# EAGLE design piezo-driver_v0.2-R001 (EAGLE 6.5.0)
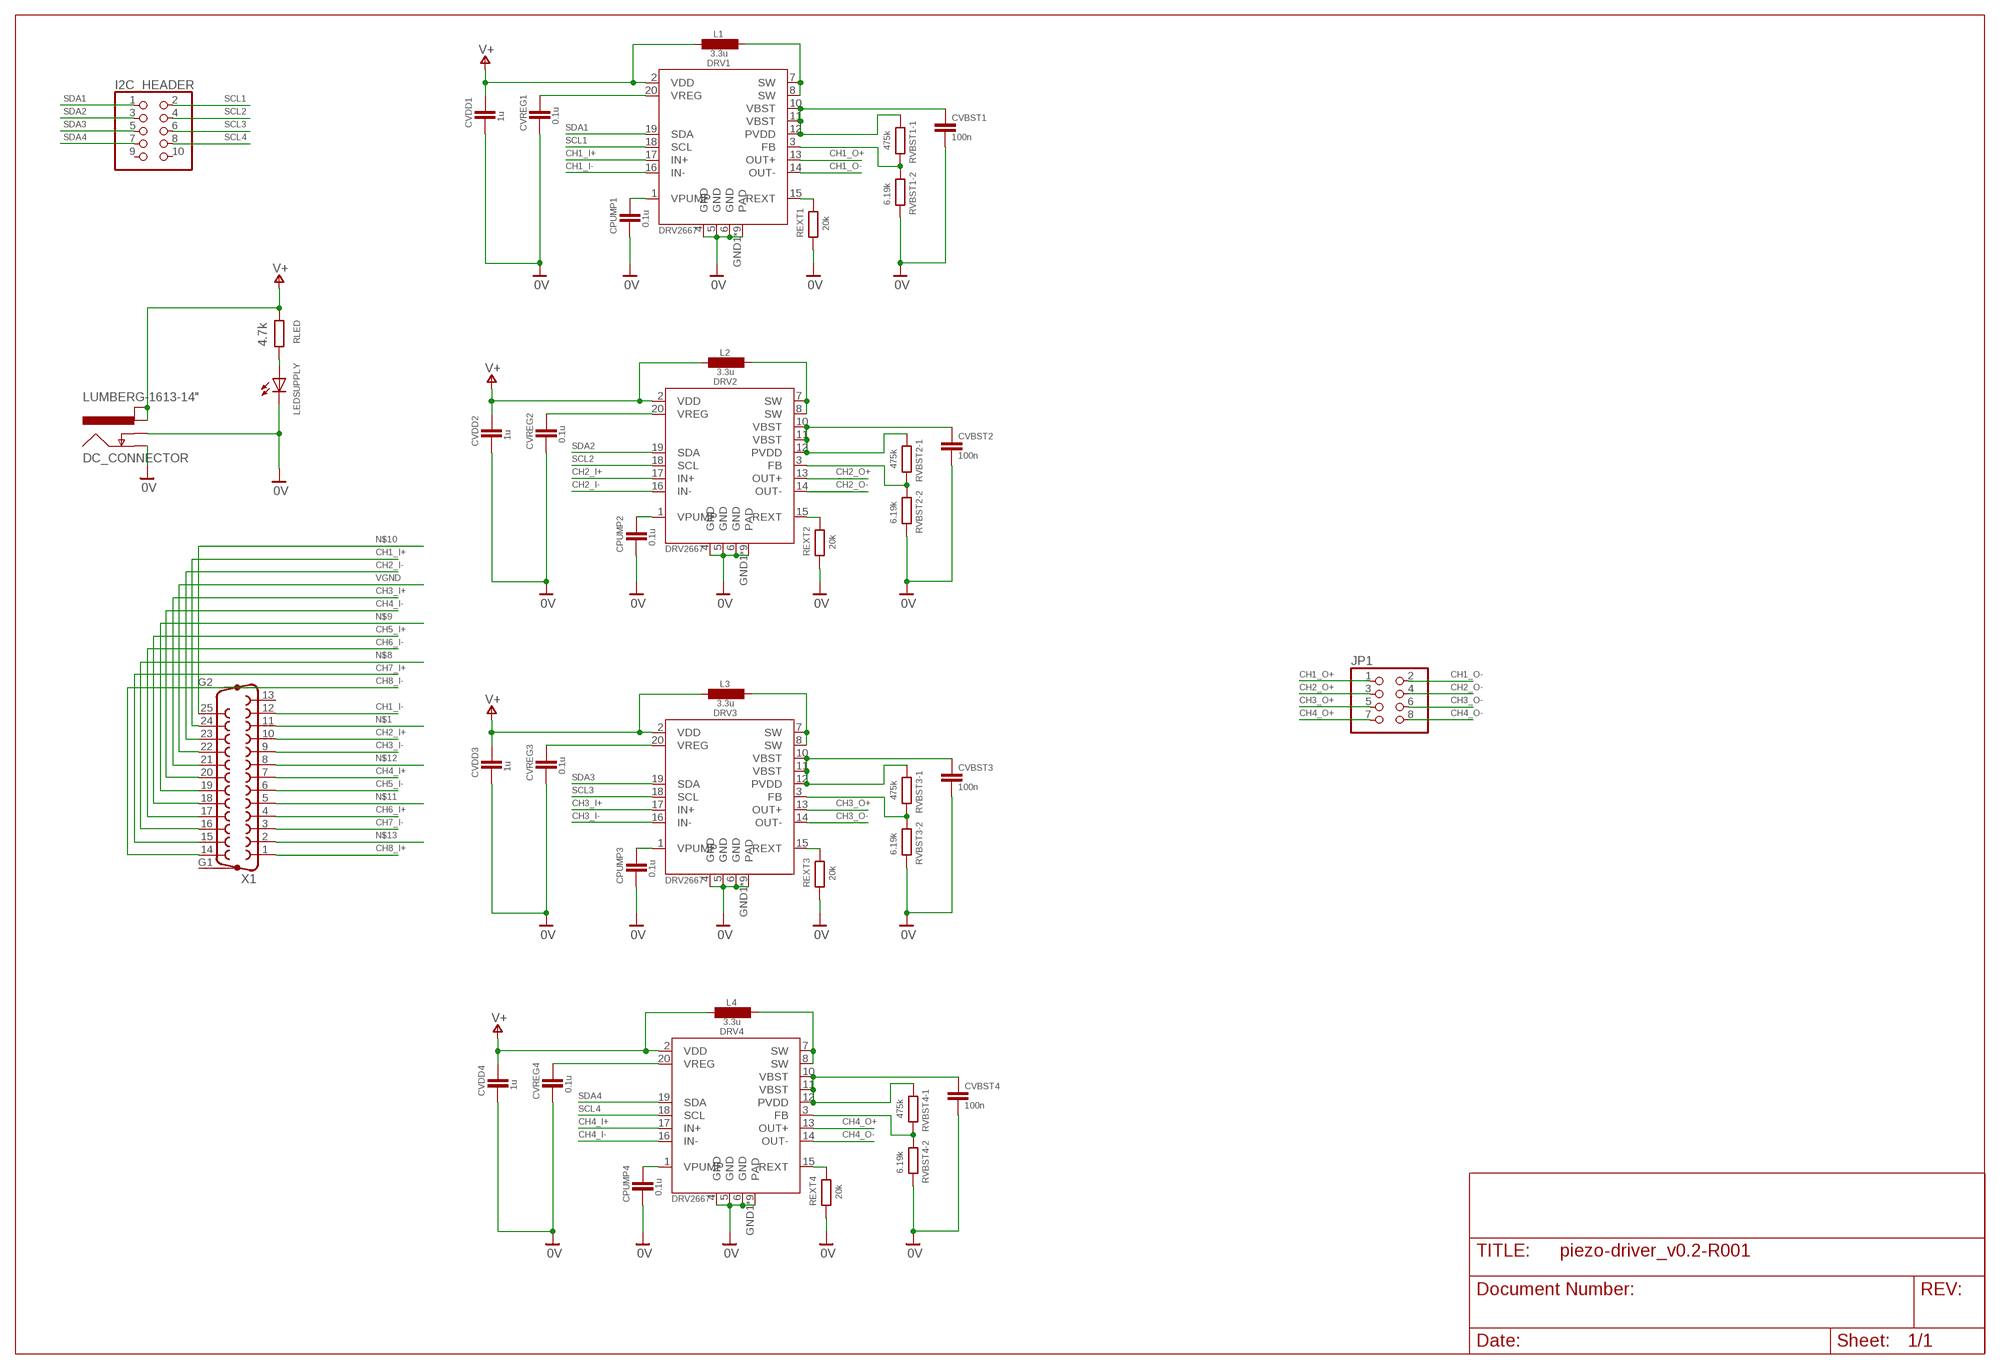
[diagram p0: schematic, sheet 1]

## Parts
CPUMP1  0.1u  C-EUC0805  [C0805]
CPUMP2  0.1u  C-EUC0805  [C0805]
CPUMP3  0.1u  C-EUC0805  [C0805]
CPUMP4  0.1u  C-EUC0805  [C0805]
CVBST1  100n  C-EUC0805  [C0805]
CVBST2  100n  C-EUC0805  [C0805]
CVBST3  100n  C-EUC0805  [C0805]
CVBST4  100n  C-EUC0805  [C0805]
CVDD1  1u  C-EUC0805  [C0805]
CVDD2  1u  C-EUC0805  [C0805]
CVDD3  1u  C-EUC0805  [C0805]
CVDD4  1u  C-EUC0805  [C0805]
CVREG1  0.1u  C-EUC0805  [C0805]
CVREG2  0.1u  C-EUC0805  [C0805]
CVREG3  0.1u  C-EUC0805  [C0805]
CVREG4  0.1u  C-EUC0805  [C0805]
DC_CONNECTOR  LUMBERG-1613-14"  [LUMBERG-1613_14]
DRV1  DRV2667QFN  [QFN400X400]
DRV2  DRV2667QFN  [QFN400X400]
DRV3  DRV2667QFN  [QFN400X400]
DRV4  DRV2667QFN  [QFN400X400]
I2C_HEADER  HEADER_2X52.54_FEMALE  [2X05_2.54]
JP1  PINHD-2X4/90  [2X04/90]
L1  3.3u  L-EUL3225M  [L3225M]
L2  3.3u  L-EUL3225M  [L3225M]
L3  3.3u  L-EUL3225M  [L3225M]
L4  3.3u  L-EUL3225M  [L3225M]
LEDSUPPLY  LED0603  [LED-0603]
REXT1  20k  R-EU_R0805  [R0805]
REXT2  20k  R-EU_R0805  [R0805]
REXT3  20k  R-EU_R0805  [R0805]
REXT4  20k  R-EU_R0805  [R0805]
RLED  4.7k  R-EU_R0805  [R0805]
RVBST1-1  475k  R-EU_R0805  [R0805]
RVBST1-2  6.19k  R-EU_R0805  [R0805]
RVBST2-1  475k  R-EU_R0805  [R0805]
RVBST2-2  6.19k  R-EU_R0805  [R0805]
RVBST3-1  475k  R-EU_R0805  [R0805]
RVBST3-2  6.19k  R-EU_R0805  [R0805]
RVBST4-1  475k  R-EU_R0805  [R0805]
RVBST4-2  6.19k  R-EU_R0805  [R0805]
X1  F25HP  [F25HP]

## Nets
0V: CPUMP1.2 CPUMP2.2 CPUMP3.2 CPUMP4.2 CVBST1.2 CVBST2.2 CVBST3.2 CVBST4.2 CVDD1.2 CVDD2.2 CVDD3.2 CVDD4.2 CVREG1.2 CVREG2.2 CVREG3.2 CVREG4.2 DC_CONNECTOR.1(GND) DC_CONNECTOR.2(GND_INS) DRV1.4(GND) DRV1.5(GND) DRV1.6(GND) DRV1.GND1(PAD) DRV1.GND2(PAD) DRV1.GND3(PAD) DRV1.GND4(PAD) DRV1.GND5(PAD) DRV1.GND6(PAD) DRV1.GND7(PAD) DRV1.GND8(PAD) DRV1.GND9(PAD) DRV2.4(GND) DRV2.5(GND) DRV2.6(GND) DRV2.GND1(PAD) DRV2.GND2(PAD) DRV2.GND3(PAD) DRV2.GND4(PAD) DRV2.GND5(PAD) DRV2.GND6(PAD) DRV2.GND7(PAD) DRV2.GND8(PAD) DRV2.GND9(PAD) DRV3.4(GND) DRV3.5(GND) DRV3.6(GND) DRV3.GND1(PAD) DRV3.GND2(PAD) DRV3.GND3(PAD) DRV3.GND4(PAD) DRV3.GND5(PAD) DRV3.GND6(PAD) DRV3.GND7(PAD) DRV3.GND8(PAD) DRV3.GND9(PAD) DRV4.4(GND) DRV4.5(GND) DRV4.6(GND) DRV4.GND1(PAD) DRV4.GND2(PAD) DRV4.GND3(PAD) DRV4.GND4(PAD) DRV4.GND5(PAD) DRV4.GND6(PAD) DRV4.GND7(PAD) DRV4.GND8(PAD) DRV4.GND9(PAD) LEDSUPPLY.C REXT1.1 REXT2.1 REXT3.1 REXT4.1 RVBST1-2.1 RVBST2-2.1 RVBST3-2.1 RVBST4-2.1
CH1_I+: DRV1.17(IN+) X1.24
CH1_I-: DRV1.16(IN-) X1.12
CH1_O+: DRV1.13(OUT+) JP1.1
CH1_O-: DRV1.14(OUT-) JP1.2
CH2_I+: DRV2.17(IN+) X1.10
CH2_I-: DRV2.16(IN-) X1.23
CH2_O+: DRV2.13(OUT+) JP1.3
CH2_O-: DRV2.14(OUT-) JP1.4
CH3_I+: DRV3.17(IN+) X1.21
CH3_I-: DRV3.16(IN-) X1.9
CH3_O+: DRV3.13(OUT+) JP1.5
CH3_O-: DRV3.14(OUT-) JP1.6
CH4_I+: DRV4.17(IN+) X1.7
CH4_I-: DRV4.16(IN-) X1.20
CH4_O+: DRV4.13(OUT+) JP1.7
CH4_O-: DRV4.14(OUT-) JP1.8
CH5_I+: X1.18
CH5_I-: X1.6
CH6_I+: X1.4
CH6_I-: X1.17
CH7_I+: X1.15
CH7_I-: X1.3
CH8_I+: X1.1
CH8_I-: X1.14
N$1: X1.11
N$2: DRV1.7(SW) DRV1.8(SW) L1.1
N$3: CVBST1.1 DRV1.10(VBST) DRV1.11(VBST) DRV1.12(PVDD) RVBST1-1.2
N$4: DRV1.3(FB) RVBST1-1.1 RVBST1-2.2
N$5: DRV1.15(REXT) REXT1.2
N$6: CPUMP1.1 DRV1.1(VPUMP)
N$7: CVREG1.1 DRV1.20(VREG)
N$8: X1.16
N$9: X1.19
N$10: X1.25
N$11: X1.5
N$12: X1.8
N$13: X1.2
N$15: LEDSUPPLY.A RLED.1
N$31: DRV2.7(SW) DRV2.8(SW) L2.1
N$32: CVBST2.1 DRV2.10(VBST) DRV2.11(VBST) DRV2.12(PVDD) RVBST2-1.2
N$33: DRV2.3(FB) RVBST2-1.1 RVBST2-2.2
N$34: DRV2.15(REXT) REXT2.2
N$35: CPUMP2.1 DRV2.1(VPUMP)
N$36: CVREG2.1 DRV2.20(VREG)
N$37: DRV3.7(SW) DRV3.8(SW) L3.1
N$38: CVBST3.1 DRV3.10(VBST) DRV3.11(VBST) DRV3.12(PVDD) RVBST3-1.2
N$39: DRV3.3(FB) RVBST3-1.1 RVBST3-2.2
N$40: DRV3.15(REXT) REXT3.2
N$41: CPUMP3.1 DRV3.1(VPUMP)
N$42: CVREG3.1 DRV3.20(VREG)
N$43: DRV4.7(SW) DRV4.8(SW) L4.1
N$44: CVBST4.1 DRV4.10(VBST) DRV4.11(VBST) DRV4.12(PVDD) RVBST4-1.2
N$45: DRV4.3(FB) RVBST4-1.1 RVBST4-2.2
N$46: DRV4.15(REXT) REXT4.2
N$47: CPUMP4.1 DRV4.1(VPUMP)
N$48: CVREG4.1 DRV4.20(VREG)
SCL1: DRV1.18(SCL) I2C_HEADER.2
SCL2: DRV2.18(SCL) I2C_HEADER.4
SCL3: DRV3.18(SCL) I2C_HEADER.6
SCL4: DRV4.18(SCL) I2C_HEADER.8
SDA1: DRV1.19(SDA) I2C_HEADER.1
SDA2: DRV2.19(SDA) I2C_HEADER.3
SDA3: DRV3.19(SDA) I2C_HEADER.5
SDA4: DRV4.19(SDA) I2C_HEADER.7
V+: CVDD1.1 CVDD2.1 CVDD3.1 CVDD4.1 DC_CONNECTOR.3(PWR_1) DC_CONNECTOR.4(PWR_2) DRV1.2(VDD) DRV2.2(VDD) DRV3.2(VDD) DRV4.2(VDD) L1.2 L2.2 L3.2 L4.2 RLED.2
VGND: X1.22
Unconnected: I2C_HEADER.9 I2C_HEADER.10 X1.13 X1.G1 X1.G2

## Library data of the parts
CPUMP1-CPUMP4 CVBST1-CVBST4 CVDD1-CVDD4 CVREG1-CVREG4 = SABRe:C-EU: CAPACITOR, European symbol
DC_CONNECTOR = SABRe:LUMBERG-1613-14
DRV1-DRV4 = ICST:DRV2667
I2C_HEADER = SABRe:HEADER_2X5: PIN HEADER
JP1 = ICST:PINHD-2X4: PIN HEADER
L1-L4 = SABRe:L-EU: INDUCTOR, European symbol
LEDSUPPLY = SABRe:LED: LEDs Standard schematic elements and footprints for packages: 5mm 3mm 1206 0603
REXT1-REXT4 RVBST1-1 RVBST1-2 RVBST2-1 RVBST2-2 RVBST3-1 RVBST3-2 RVBST4-1 RVBST4-2 = SABRe:R-EU_: RESISTOR, European symbol
RLED = rcl:R-EU_: RESISTOR, European symbol
X1 = ICST:F25HP: SUB-D; OC_FARNELL: unknown; OC_NEWARK: unknown

## Board
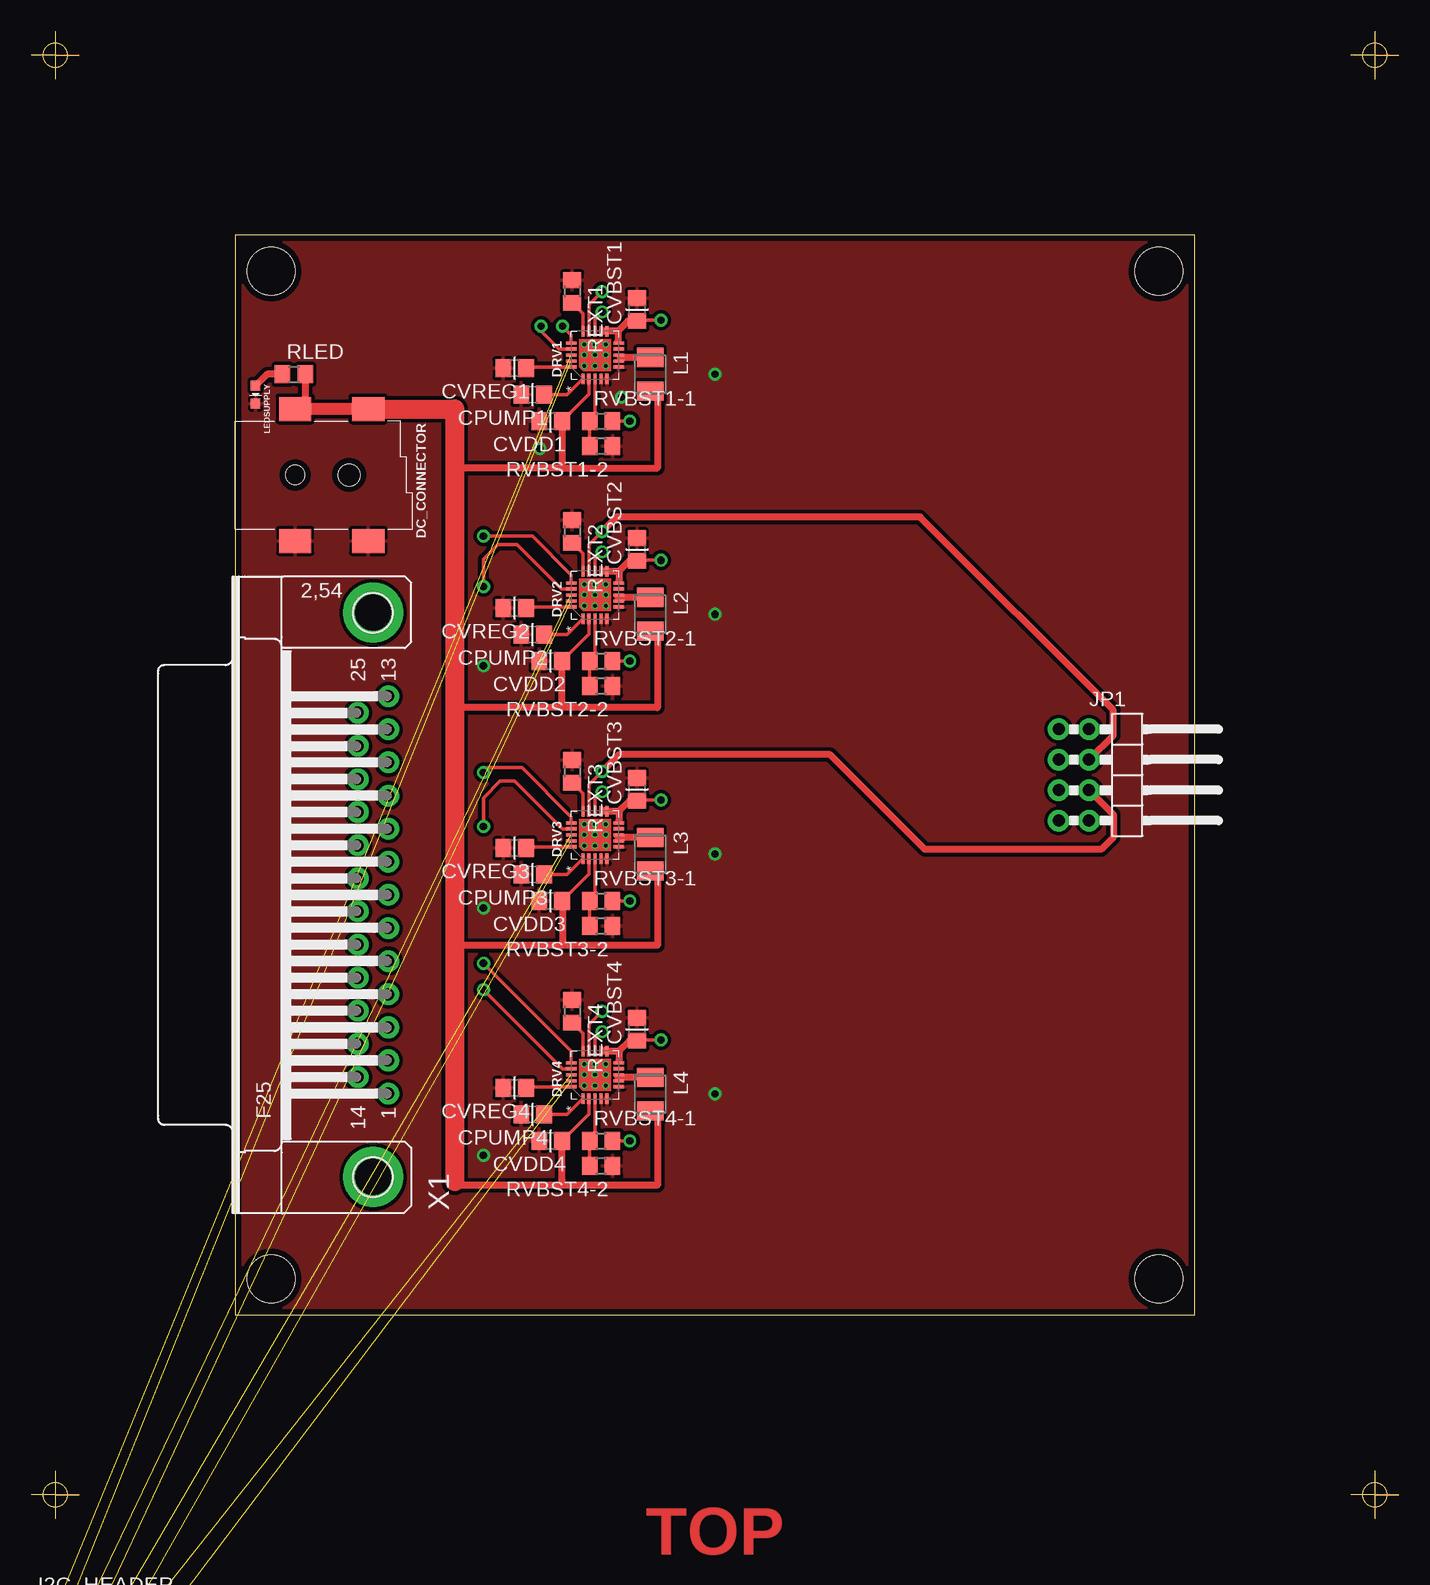
[diagram p1: board, top side]
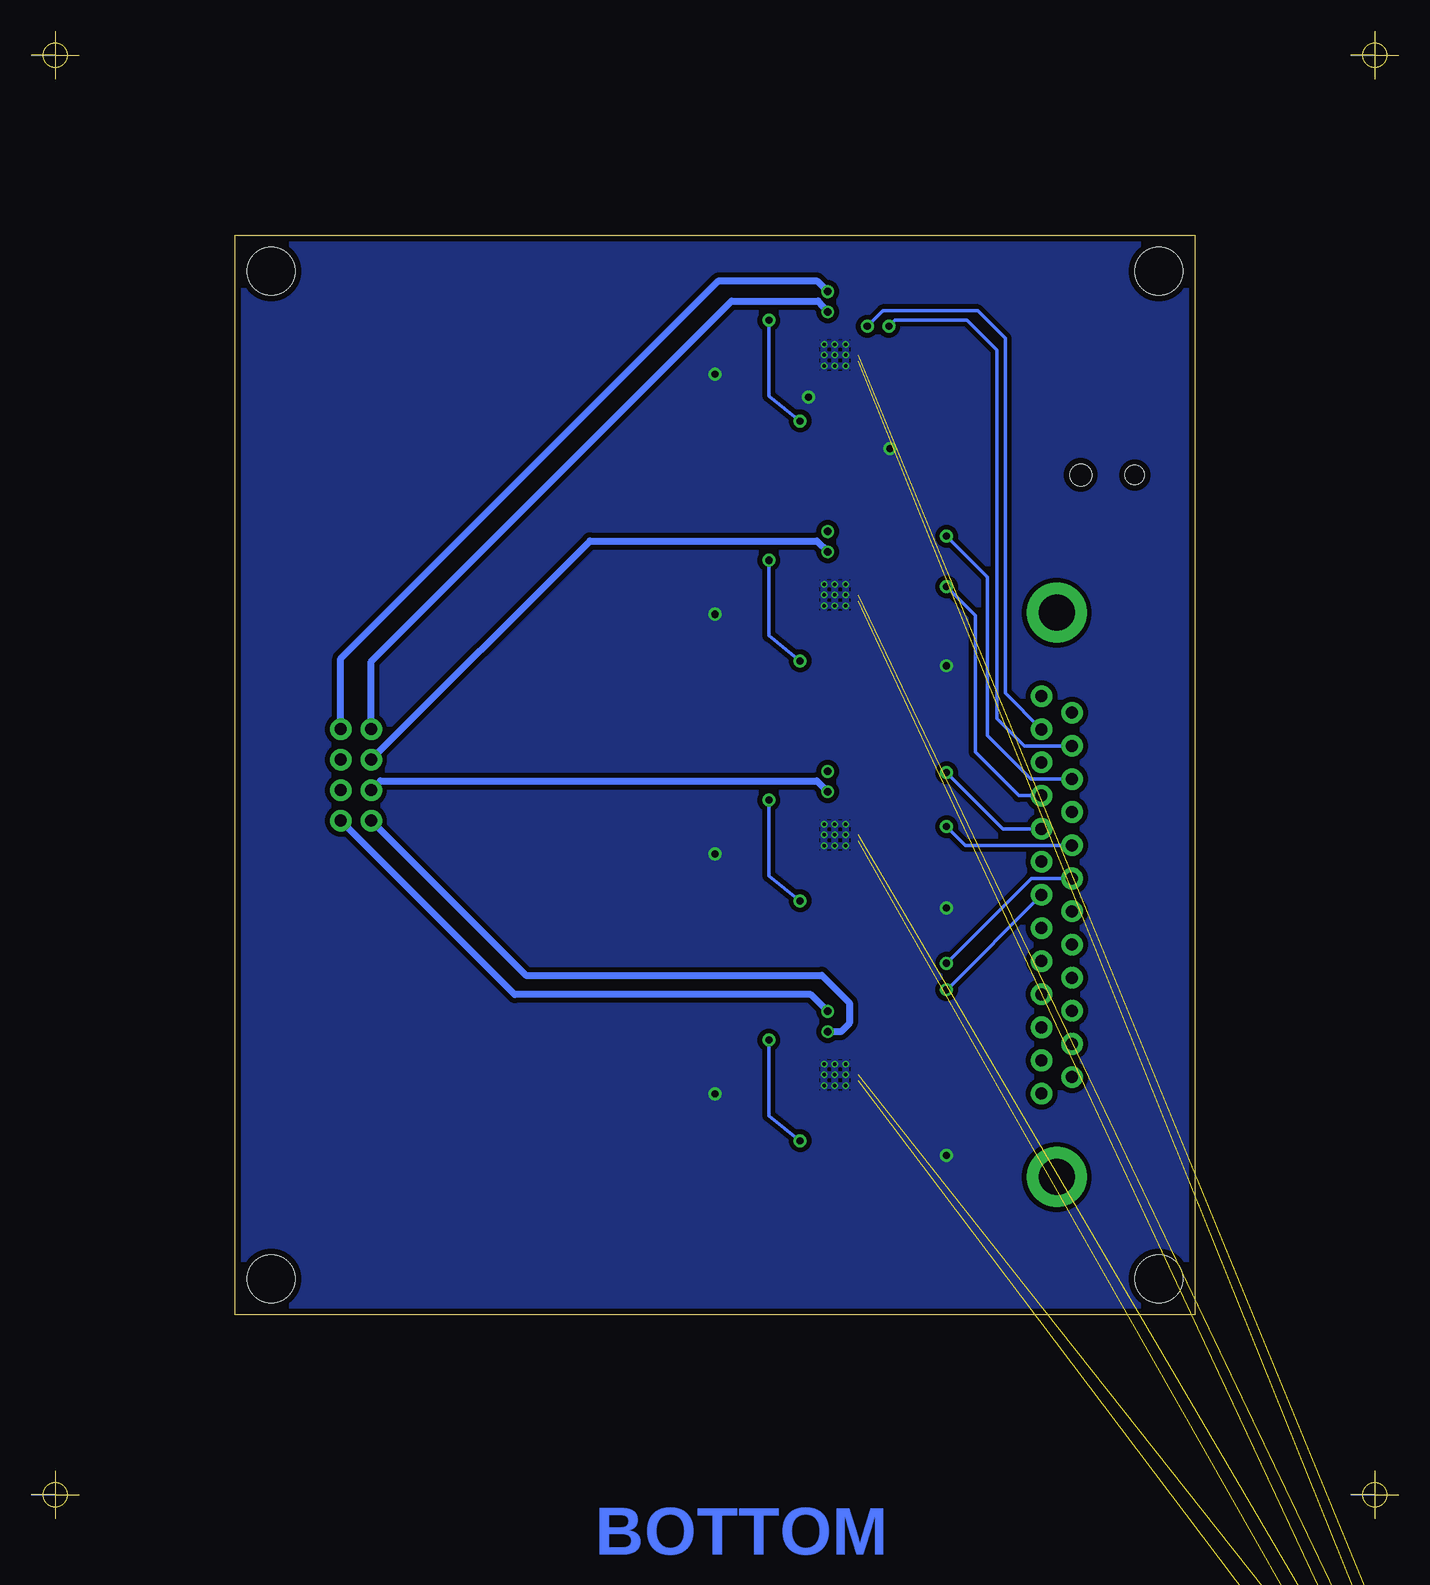
[diagram p2: board, bottom side, seen from below]

Size 114 x 124 mm. Coordinates in mm from the lower left corner, seen from the top.
Outline: 2,2 4,2
Outline: 2,4 2,2
Outline: 2,2 2,0
Outline: 2,2 0,2
Outline: 112,2 114,2
Outline: 112,4 112,2
Outline: 112,2 112,0
Outline: 112,2 110,2
Outline: 2,122 4,122
Outline: 2,124 2,122
Outline: 2,122 2,120
Outline: 2,122 0,122
Outline: 112,122 114,122
Outline: 112,124 112,122
Outline: 112,122 112,120
Outline: 112,122 110,122
Outline: 17,107 17,17 97,17 97,107 17,107
Outline: circle at 2,2 radius 1
Outline: circle at 112,2 radius 1
Outline: circle at 2,122 radius 1
Outline: circle at 112,122 radius 1
Copper layers (1*16): Top 0.035mm / dielectric 1.5mm / Bottom 0.035mm
Design rules "ICST_etching": minimum track width 0.3mm, minimum drill 0.6mm, track to track 0.15mm, track to pad 0.15mm, pad to pad 0.15mm, via to via 0.15mm, smd to smd 0.15mm, copper to edge 0.5mm, drill to drill 0.3mm, minimum pad ring 0.1mm, minimum via ring 0.1mm, stop-mask expansion 4mil, vias tented up to drill 25mil, thermal gap 10mil
Holes 4 mm at 20,104 94,104 94,20 20,20

### Footprints (pad centres in the part's own frame; a part is rotated, then mirrored left to right if it is on the bottom)
C0805 = smd 1.3 x 1.5: 1 -0.95,0; 2 0.95,0
LUMBERG-1613_14 = smd 2 x 2.7: 1 5.5,5; 2 5.5,11.1; 3 -5.5,11.1; 4 -5.5,5 | hole 1.6: 0,5 | hole 1.8: 0,9.5
QFN400X400 = smd 0.85 x 0.28: 1 -1.981,0.991; 2 -1.981,0.508; 3 -1.981,0; 4 -1.981,-0.508; 5 -1.981,-0.991; 11 1.981,-0.991; 12 1.981,-0.508; 13 1.981,0; 14 1.981,0.508; 15 1.981,0.991 | smd 0.28 x 0.85: 6 -0.991,-1.981; 7 -0.508,-1.981; 8 0,-1.981; 9 0.508,-1.981; 10 0.991,-1.981; 16 0.991,1.981; 17 0.508,1.981; 18 0,1.981; 19 -0.508,1.981; 20 -0.991,1.981 | drill 0.3 pad 0.4: GND1 -0.9,0.9; GND2 0,0.9; GND3 0.9,0.9; GND4 -0.9,0; GND5 0,0; GND6 0.9,0; GND7 -0.9,-0.9; GND8 0,-0.9; GND9 0.9,-0.9
2X05_2.54 = drill 1: 1 -5.08,-1.27; 2 -5.08,1.27; 3 -2.54,-1.27; 4 -2.54,1.27; 5 0,-1.27; 6 0,1.27; 7 2.54,-1.27; 8 2.54,1.27; 9 5.08,-1.27; 10 5.08,1.27
2X04/90 = drill 1: 1 -3.81,-6.35; 2 -3.81,-3.81; 3 -1.27,-6.35; 4 -1.27,-3.81; 5 1.27,-6.35; 6 1.27,-3.81; 7 3.81,-6.35; 8 3.81,-3.81
L3225M = smd 1.6 x 2.2: 1 -1.4,0; 2 1.4,0
LED-0603 = smd 0.8 x 0.8: A 0,-0.75; C 0,0.75
R0805 = smd 1.3 x 1.5: 1 -0.95,0; 2 0.95,0
F25HP = drill 1: 1 -16.561,-1.27; 2 -13.792,-1.27; 3 -11.049,-1.27; 4 -8.28,-1.27; 5 -5.512,-1.27; 6 -2.769,-1.27; 7 0,-1.27; 8 2.769,-1.27; 9 5.512,-1.27; 10 8.28,-1.27; 11 11.049,-1.27; 12 13.792,-1.27; 13 16.561,-1.27; 14 -15.189,1.27; 15 -12.421,1.27; 16 -9.652,1.27; 17 -6.909,1.27; 18 -4.14,1.27; 19 -1.372,1.27; 20 1.372,1.27; 21 4.14,1.27; 22 6.909,1.27; 23 9.652,1.27; 24 12.421,1.27; 25 15.189,1.27 | drill 3 pad 5: G1 -23.52,0; G2 23.52,0

### Placement (x,y rotation side)
CPUMP1  41.8,93.7 180 top
CPUMP2  41.8,73.7 180 top
CPUMP3  41.8,53.7 180 top
CPUMP4  41.8,33.7 180 top
CVBST1  50.5,100.8 90 top
CVBST2  50.5,80.8 90 top
CVBST3  50.5,60.8 90 top
CVBST4  50.5,40.8 90 top
CVDD1  43.3,91.5 180 top
CVDD2  43.3,71.5 180 top
CVDD3  43.3,51.5 180 top
CVDD4  43.3,31.5 180 top
CVREG1  40.3,95.9 180 top
CVREG2  40.3,75.9 180 top
CVREG3  40.3,55.9 180 top
CVREG4  40.3,35.9 180 top
DC_CONNECTOR  17,87 270 top
DRV1  47,97 90 top
DRV2  47,77 90 top
DRV3  47,57 90 top
DRV4  47,37 90 top
I2C_HEADER  6.9,-9.3 0 top  (outside the outline)
JP1  92,62 270 top
L1  51.6,95.4 270 top
L2  51.6,75.4 270 top
L3  51.6,55.4 270 top
L4  51.6,35.4 270 top
LEDSUPPLY  18.7,93.7 180 top
REXT1  45.1,102.3 270 top
REXT2  45.1,82.3 270 top
REXT3  45.1,62.3 270 top
REXT4  45.1,42.3 270 top
RLED  21.9,95.4 0 top
RVBST1-1  47.5,91.5 0 top
RVBST1-2  47.5,89.4 180 top
RVBST2-1  47.5,71.5 0 top
RVBST2-2  47.5,69.4 180 top
RVBST3-1  47.5,51.5 0 top
RVBST3-2  47.5,49.4 180 top
RVBST4-1  47.5,31.5 0 top
RVBST4-2  47.5,29.4 180 top
X1  28.5,52 90 top

### Tracks (layer width: path | path; a pad name or v marks a point on that pad's centre or on a via)
0V  (via drill 0.6)
  other vias: 42.4,89.2 49.2,93.5 37.7,50.9 37.7,71.1 37.7,30.3 57,55.4 57,75.4 57,95.4 57,35.4
  pour Top (isolate 0.3): 17,107 97,107 97,17 17,17
  pour Bottom (isolate 0.4): 17,107 97,107 97,17 17,17
CH1_I+  (via drill 0.6)
  Top 0.3: DRV1.17 43.99,97.51 42.5,99 v42.5,99.4
  Bottom 0.3: X1.24 31.2,64.42 33.5,66.72 33.5,97.4 36,99.9 42,99.9 v42.5,99.4
CH1_I-  (via drill 0.6)
  Top 0.3: DRV1.16 45.02,98.68 v44.3,99.4
  Bottom 0.3: X1.12 32.8,68.82 32.8,98.4 35.1,100.7 43,100.7 v44.3,99.4
CH1_O+  (via drill 0.6)
  Top 0.3: DRV1.13 47,100 v47.6,100.6
  Bottom 0.6: JP1.1 85.65,71.45 55.6,101.5 48.4,101.5 v47.6,100.6
CH1_O-  (via drill 0.6)
  Top 0.3: DRV1.14 46.49,101.19 v47.6,102.3
  Bottom 0.6: JP1.2 88.19,71.71 56.7,103.2 48.5,103.2 v47.6,102.3
CH2_I+  (via drill 0.6)
  Top 0.3: v37.7,77.7 37.7,80 38.9,81.2 40.5,81.2 44.19,77.51 DRV2.17
  Bottom 0.3: X1.10 31.68,60.28 35.3,63.9 35.3,75.3 v37.7,77.7
CH2_I-  (via drill 0.6)
  Top 0.3: v37.7,81.9 41.8,81.9 45.02,78.68 DRV2.16
  Bottom 0.3: X1.23 30.65,61.65 34.3,65.3 34.3,78.5 v37.7,81.9
CH2_O+  (via drill 0.6)
  Top 0.3: DRV2.13 47,80 v47.6,80.6
  Bottom 0.6: JP1.3 67.42,81.5 48.5,81.5 v47.6,80.6
CH2_O-  (via drill 0.6)
  Top 0.3: DRV2.14 46.49,81.19 v47.6,82.3
  Top 0.6: JP1.4 90.2,65.28 90.2,67.4 74.1,83.5 48.8,83.5 v47.6,82.3
CH3_I+  (via drill 0.6)
  Top 0.3: DRV3.17 44.29,57.51 40.3,61.5 39.1,61.5 37.7,60.1 v37.7,57.7
  Bottom 0.3: X1.21 36.14,56.14 v37.7,57.7
CH3_I-  (via drill 0.6)
  Top 0.3: v37.7,62.2 38.1,62.6 40.9,62.6 45.02,58.48 DRV3.16
  Bottom 0.3: X1.9 33.01,57.51 v37.7,62.2
CH3_O+  (via drill 0.6)
  Top 0.3: DRV3.13 47,60 v47.6,60.6
  Bottom 0.6: JP1.5 84.88,61.5 48.5,61.5 v47.6,60.6
CH3_O-  (via drill 0.6)
  Top 0.3: DRV3.14 46.49,61.19 v47.6,62.3
  Top 0.6: JP1.6 90.2,58.72 90.2,56.8 89.2,55.8 74.5,55.8 66.6,63.7 49,63.7 v47.6,62.3
CH4_I+  (via drill 0.6)
  Top 0.3: v37.7,44.1 44.29,37.51 DRV4.17
  Bottom 0.3: X1.7 37.67,44.1
  Bottom 0.6: 37.67,44.1 v37.7,44.1
CH4_I-  (via drill 0.6)
  Top 0.3: v37.7,46.3 45.02,38.98 DRV4.16
  Bottom 0.3: X1.20 30.63,53.37 v37.7,46.3
CH4_O+  (via drill 0.6)
  Top 0.3: DRV4.13 47,40 v47.6,40.6
  Bottom 0.6: v47.6,40.6 46.5,40.6 45.8,41.3 45.8,43 48.1,45.3 72.76,45.3 JP1.7
CH4_O-  (via drill 0.6)
  Top 0.3: DRV4.14 46.49,41.19 v47.6,42.3
  Bottom 0.6: JP1.8 73.7,43.7 49,43.7 v47.6,42.3
N$2
  Top 0.3: 49.5,96.8 48.98,96.8 DRV1.7 DRV1.8
  Top 0.6: L1.1 49.5,96.8 49.4,96.8
N$3  (via drill 0.6)
  Top 0.3: 47.99,99 DRV1.11 DRV1.12 | DRV1.10 48.98,98.12 48.9,98.2 | 48.78,98.98 48.9,98.9 | RVBST1-1.2 v49.9,91.5 | v52.5,99.9 50.5,99.9 CVBST1.1
  Top 0.6: CVBST1.1 49.75,99.85 48.9,99 48.9,98.9 48.9,98.2 | 48.78,98.98 DRV1.11 47.69,98.99
  Bottom 0.3: v49.9,91.5 52.5,93.6 v52.5,99.9
N$4
  Top 0.3: DRV1.3 47,91.9 RVBST1-1.1 RVBST1-2.2
N$5
  Top 0.3: DRV1.15 46.01,100.44 REXT1.2
N$6
  Top 0.3: DRV1.1 44.69,93.7 CPUMP1.1
N$7
  Top 0.3: DRV1.20 41.25,96.01 CVREG1.1
N$14
  Top 0.1: 2,124 2,120
N$15
  Top 0.6: RLED.1 19.65,95.4 LEDSUPPLY.A
N$16
  Top 0.1: 4,122 0,122
N$17
  Bottom 0.1: 2,124 2,120
N$18
  Bottom 0.1: 4,122 0,122
N$19
  Top 0.1: 112,124 112,120
N$20
  Top 0.1: 114,122 110,122
N$21
  Bottom 0.1: 112,124 112,120
N$22
  Bottom 0.1: 114,122 110,122
N$23
  Top 0.1: 2,4 2,0
N$24
  Top 0.1: 4,2 0,2
N$25
  Bottom 0.1: 2,4 2,0
N$26
  Bottom 0.1: 4,2 0,2
N$27
  Top 0.1: 112,4 112,0
N$28
  Top 0.1: 114,2 110,2
N$29
  Bottom 0.1: 112,4 112,0
N$30
  Bottom 0.1: 114,2 110,2
N$31
  Top 0.3: 48.9,76.8 48.9,76.92 DRV2.8 DRV2.7
  Top 0.6: L2.1 48.9,76.8
N$32  (via drill 0.6)
  Top 0.3: 47.7,79 47.51,79 DRV2.12 47.7,78.99 | DRV2.10 49,77.99 49,78.2 | RVBST2-1.2 v49.9,71.5 | v52.5,79.9 50.5,79.9 CVBST2.1
  Top 0.6: 49,78.98 DRV2.11 47.7,78.99 | 49,78.98 49,78.2 | CVBST2.1 49.87,79.85 49,78.98
  Bottom 0.3: v49.9,71.5 52.5,73.6 v52.5,79.9
N$33
  Top 0.3: DRV2.3 47,71.55 RVBST2-1.1 RVBST2-2.2
N$34
  Top 0.3: DRV2.15 46.01,80.44 REXT2.2
N$35
  Top 0.3: DRV2.1 44.69,73.7 CPUMP2.1
N$36
  Top 0.3: DRV2.20 41.25,76.01 CVREG2.1
N$37
  Top 0.3: DRV3.7 DRV3.8 49,56.98 49,56.8
  Top 0.6: L3.1 49,56.8 48.9,56.8
N$38  (via drill 0.6)
  Top 0.3: RVBST3-1.2 v49.9,51.5 | CVBST3.1 50.55,59.9 v52.5,59.9 | DRV3.12 DRV3.11 | DRV3.10 49,57.99 49,58.2
  Top 0.6: 49,58.98 DRV3.11 47.7,58.98 | 49,58.98 49,58.2 | CVBST3.1 49.87,59.85 49,58.98
  Bottom 0.3: v49.9,51.5 52.5,53.6 v52.5,59.9
N$39
  Top 0.3: DRV3.3 47,51.5 RVBST3-1.1 RVBST3-2.2
N$40
  Top 0.3: DRV3.15 46.01,60.44 REXT3.2
N$41
  Top 0.3: DRV3.1 44.69,53.7 CPUMP3.1
N$42
  Top 0.3: DRV3.20 41.25,56.01 CVREG3.1
N$43
  Top 0.3: 48.9,36.8 48.98,36.8 DRV4.8 DRV4.7
  Top 0.6: L4.1 48.9,36.8
N$44  (via drill 0.6)
  Top 0.3: DRV4.12 DRV4.11 | 49,38.2 48.98,38.2 DRV4.10 | RVBST4-1.2 v49.9,31.5 | v52.5,39.9 50.5,39.9 CVBST4.1
  Top 0.6: 49,38.98 DRV4.11 47.7,38.98 | 49,38.98 49,38.2 | CVBST4.1 49.87,39.85 49,38.98
  Bottom 0.3: v49.9,31.5 52.5,33.6 v52.5,39.9
N$45
  Top 0.3: DRV4.3 47,31.55 RVBST4-1.1 RVBST4-2.2
N$46
  Top 0.3: DRV4.15 46.01,40.44 REXT4.2
N$47
  Top 0.3: DRV4.1 44.69,33.7 CPUMP4.1
N$48
  Top 0.3: DRV4.20 41.25,36.01 CVREG4.1
SCL1  (1 unrouted)
SCL2  (1 unrouted)
SCL3  (1 unrouted)
SCL4  (1 unrouted)
SDA1  (1 unrouted)
SDA2  (1 unrouted)
SDA3  (1 unrouted)
SDA4  (1 unrouted)
V+
  Top 0.3: DRV1.2 46.49,93.74 CVDD1.1 | DRV2.2 46.49,73.74 CVDD2.1 | DRV3.2 46.49,53.74 CVDD3.1 | DRV4.2 46.49,33.74 CVDD4.1
  Top 0.6: RLED.2 22.85,92.5 DC_CONNECTOR.4 | 28.4,92.5 DC_CONNECTOR.3 | L1.2 52.2,94 52.2,87.6 44.25,87.6 | CVDD1.1 44.25,87.6 | 44.25,87.6 35.3,87.6 | L2.2 52.2,74 52.2,67.6 44.25,67.6 | 44.25,67.6 CVDD2.1 | 44.25,67.6 35.3,67.6 | L3.2 52.2,54 52.2,47.8 44.3,47.8 | 44.3,47.8 35.3,47.8 | CVDD3.1 44.3,51.5 44.3,47.8 | L4.2 52.2,34 52.2,27.8 44.25,27.8 | 44.25,27.8 CVDD4.1 | 44.25,27.8 35.3,27.8 35.3,29.1
  Top 1: DC_CONNECTOR.3 DC_CONNECTOR.4
  Top 1.6: 28.4,92.5 35.3,92.5 35.3,87.6 35.3,67.6 35.3,47.8 35.3,29.1 35.3,28.1
(copper drawn outside any net)
  shapes: Bottom circle x4, Top circle x4

### Text on the board
Top: TOP
Bottom: BOTTOM